# Altium schematic sheet SystemLevelR3.SchDoc
size E
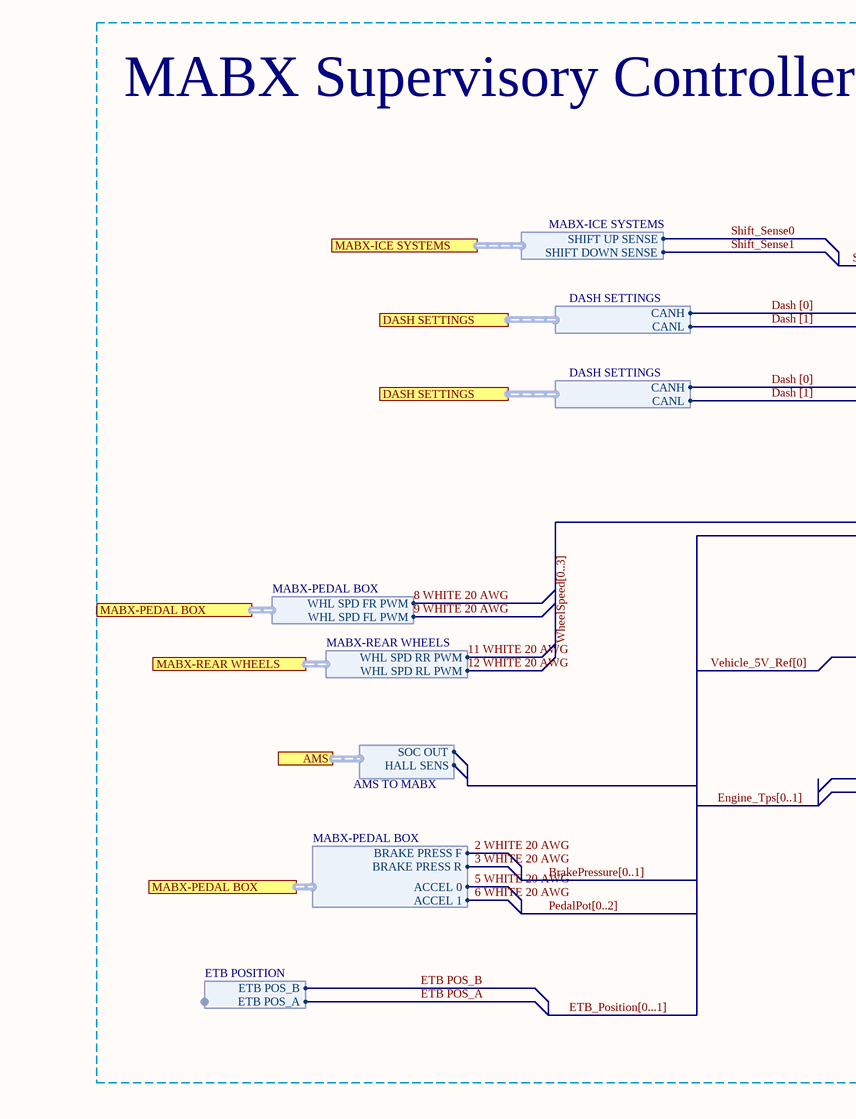
[diagram p0: SystemLevelR3.SchDoc, top left]
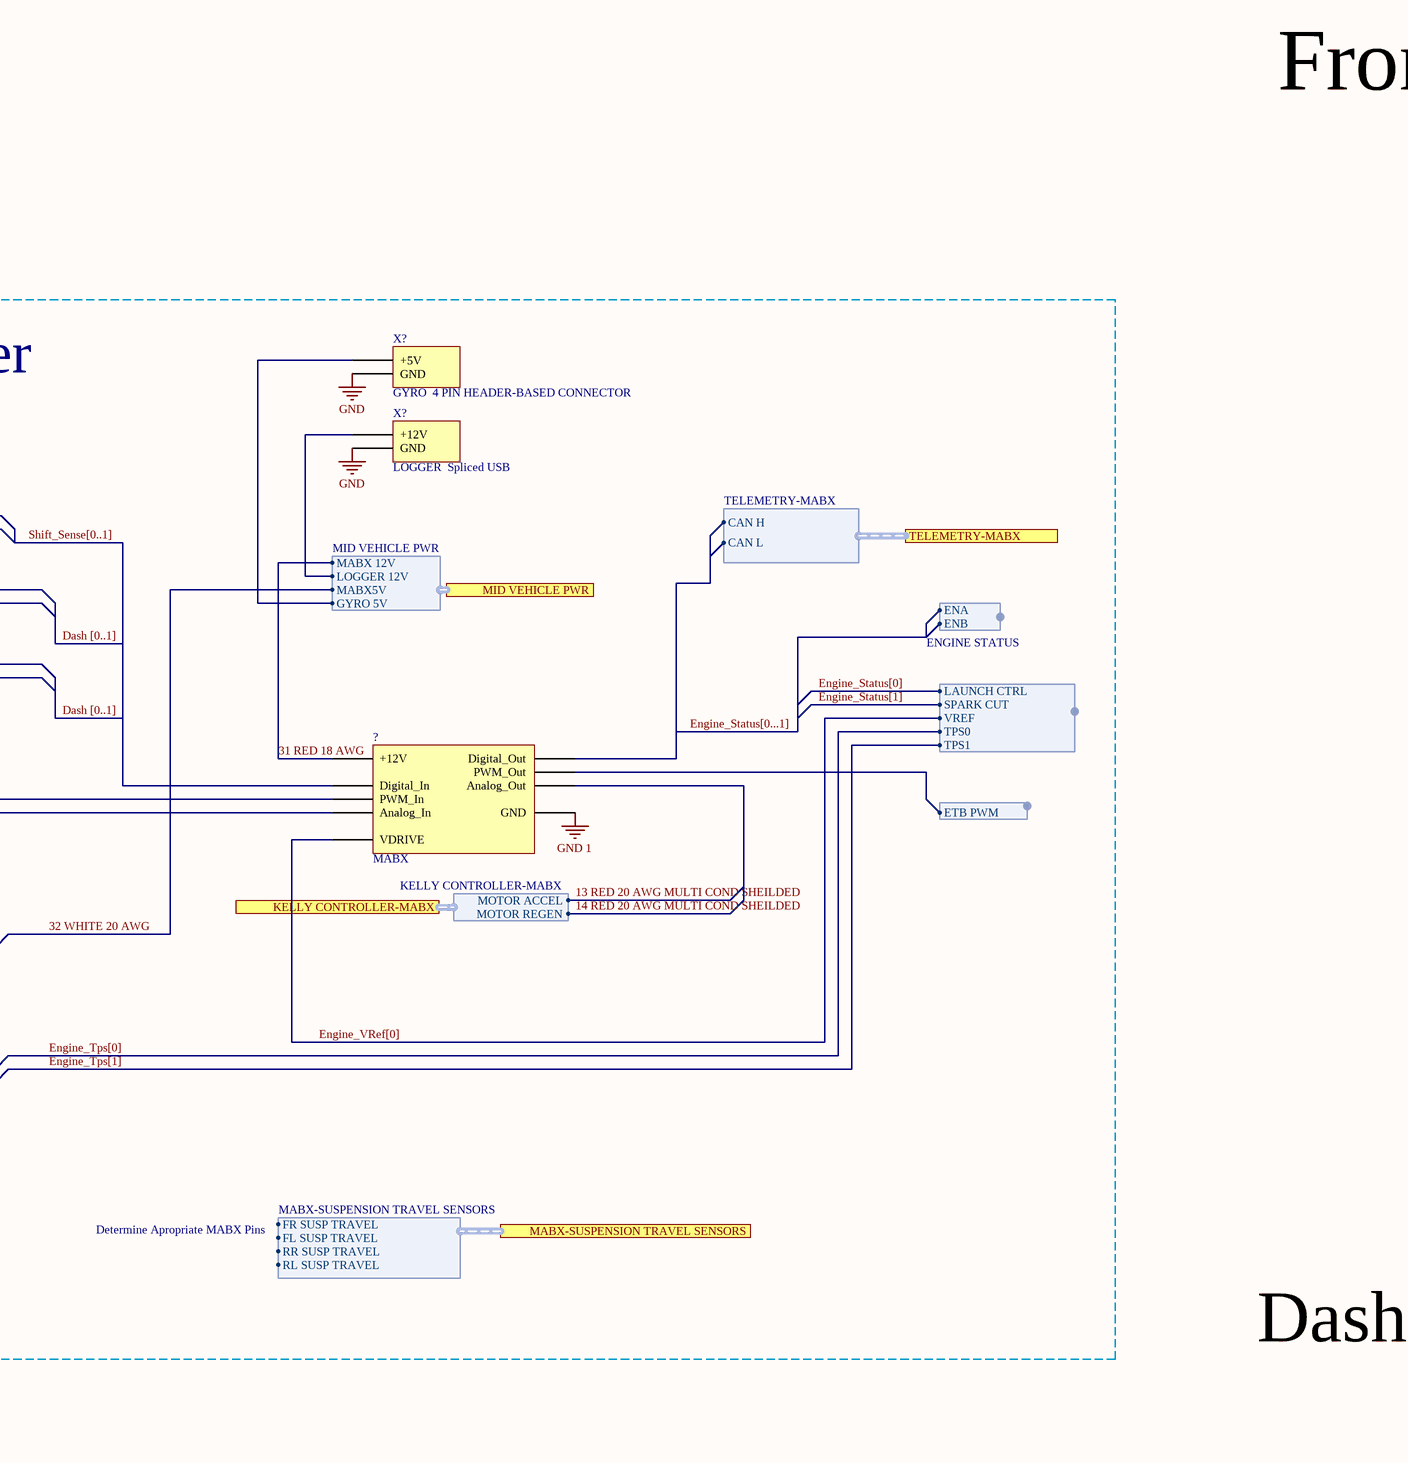
[diagram p1: SystemLevelR3.SchDoc, top middle]
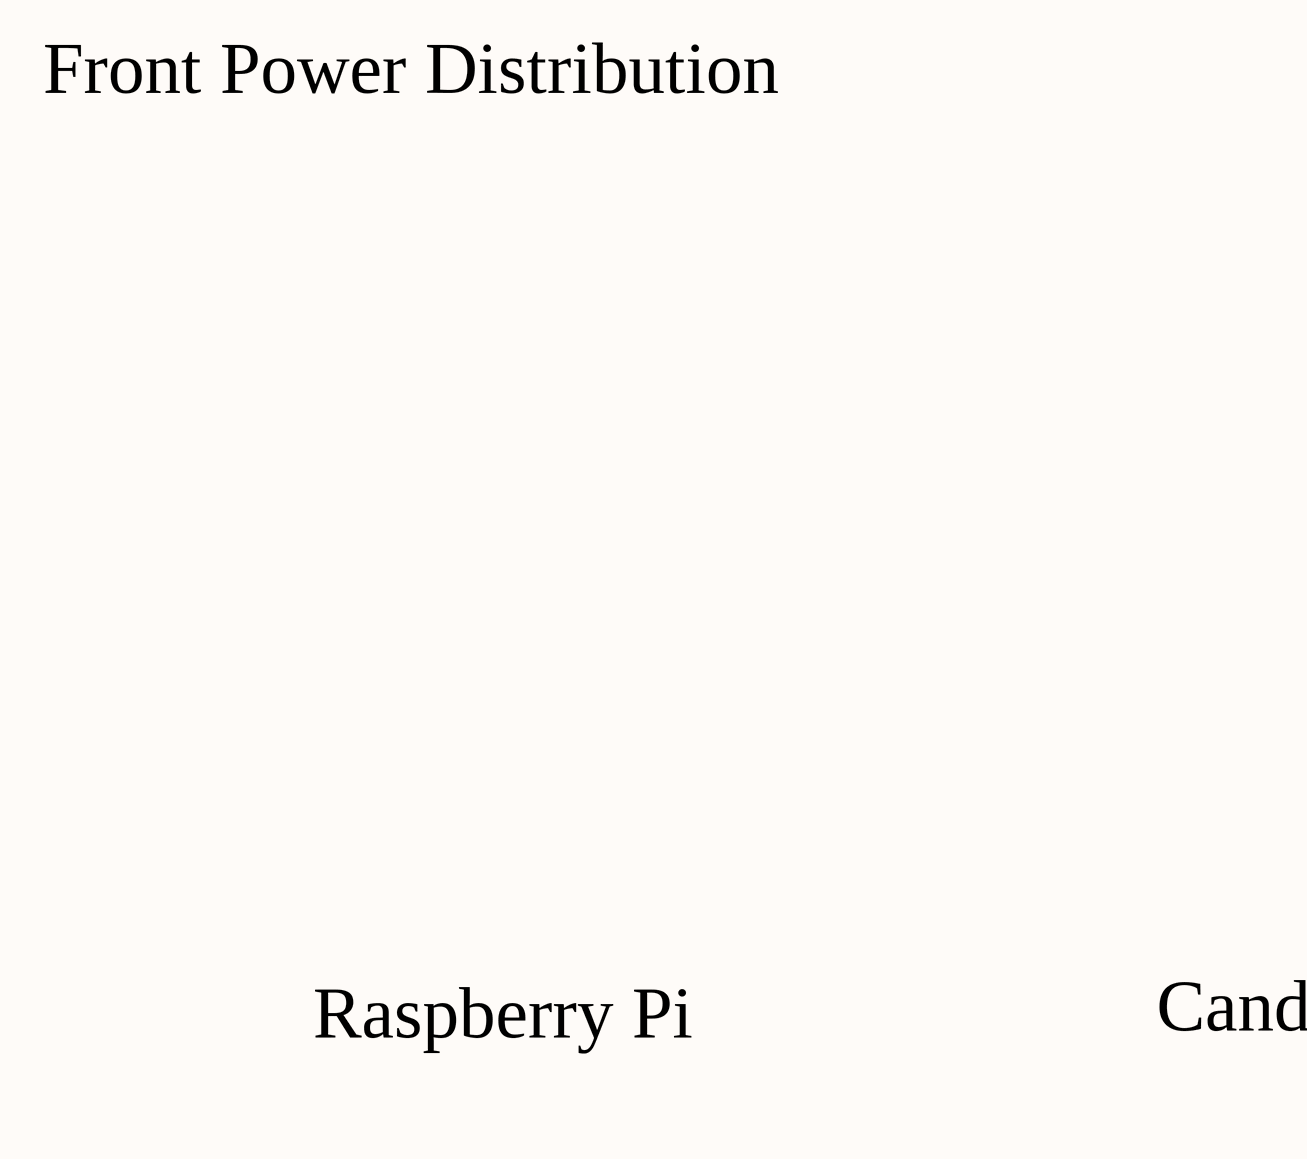
[diagram p2: SystemLevelR3.SchDoc, top right]
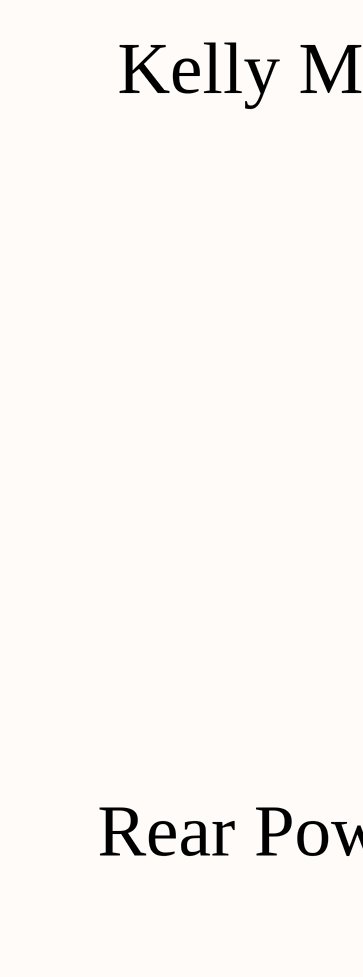
[diagram p3: SystemLevelR3.SchDoc, bottom left]
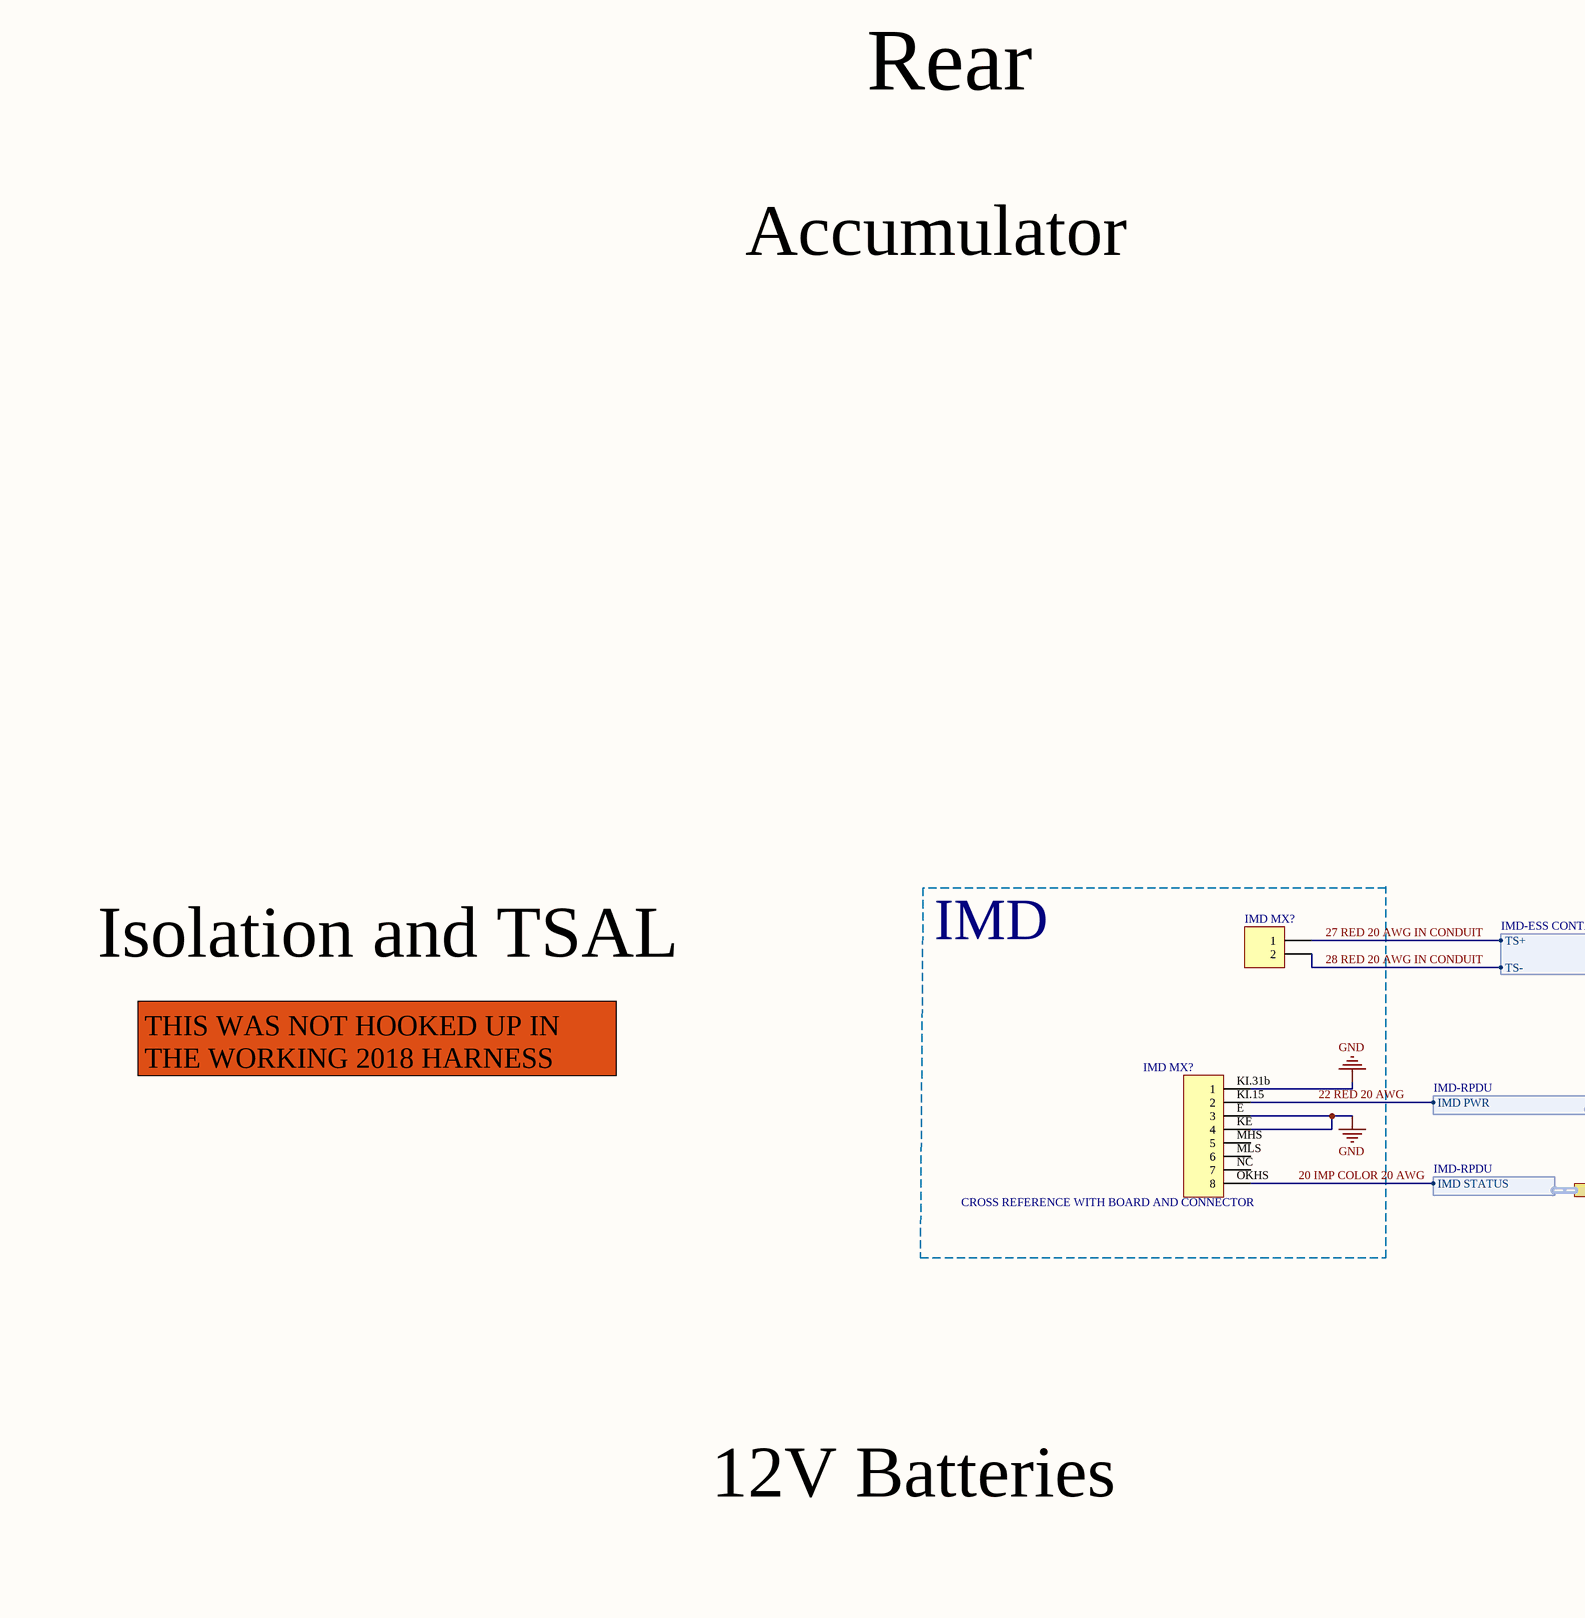
[diagram p4: SystemLevelR3.SchDoc, bottom middle]
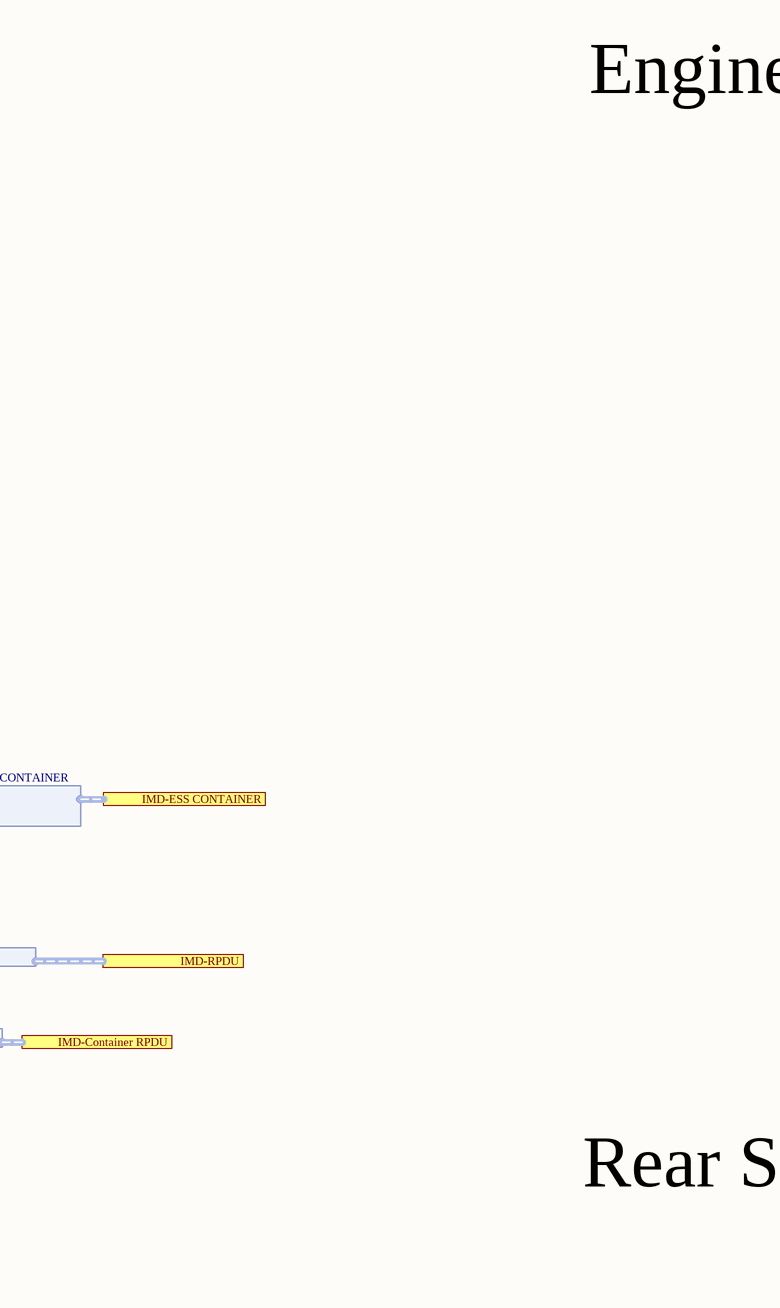
[diagram p5: SystemLevelR3.SchDoc, bottom right]

## Parts
(Parts that share a designator on the sheet are numbered #1, #2 ... from top to bottom, then left to right.)
?  MABX
IMD_MX?#1  Header 2  [HDR1X2]  (value not drawn)
IMD_MX?#2  CROSS REFERENCE WITH BOARD AND CONNECTOR  [HDR1X8]
X?#1  GYRO  4 PIN HEADER-BASED CONNECTOR
X?#2  LOGGER  Spliced USB

## Blocks framed on the sheet
MABX Supervisory Controller: ? X?#1 X?#2
IMD: IMD_MX?#1 IMD_MX?#2

## Ports
AMS (harness AMS TO MABX), DASH SETTINGS (harness DASH SETTINGS), IMD-Container RPDU (harness IMD-RPDU), IMD-ESS CONTAINER (harness IMD-ESS CONTAINER), IMD-RPDU (harness IMD-RPDU), KELLY CONTROLLER-MABX (harness KELLY CONTROLLER-MABX), MABX-ICE SYSTEMS (harness MABX-ICE SYSTEMS), MABX-PEDAL BOX (harness MABX-PEDAL BOX), MABX-REAR WHEELS (harness MABX-REAR WHEELS), MABX-SUSPENSION TRAVEL SENSORS (harness MABX-SUSPENSION TRAVEL SENSORS), MID VEHICLE PWR (harness MID VEHICLE PWR), TELEMETRY-MABX (harness TELEMETRY-MABX)

## Harnesses
ETB POSITION: ETB POS_A, ETB POS_B
MID VEHICLE PWR: MABX 12V, LOGGER 12V, GYRO 5V, MABX5V
MABX-PEDAL BOX: BRAKE PRESS F, BRAKE PRESS R, ACCEL 0, ACCEL 1
DASH SETTINGS: CANH, CANL
ENGINE STATUS: LAUNCH CTRL, SPARK CUT, VREF, TPS0, TPS1
AMS TO MABX: SOC OUT, HALL SENS
Harness: ENA, ENB
Harness: ETB PWM
TELEMETRY-MABX: CAN H, CAN L
MABX-ICE SYSTEMS: SHIFT UP SENSE, SHIFT DOWN SENSE
MABX-REAR WHEELS: WHL SPD RR PWM, WHL SPD RL PWM
KELLY CONTROLLER-MABX: MOTOR ACCEL, MOTOR REGEN
MABX-PEDAL BOX: WHL SPD FR PWM, WHL SPD FL PWM
MABX-SUSPENSION TRAVEL SENSORS: FR SUSP TRAVEL, FL SUSP TRAVEL, RR SUSP TRAVEL, RL SUSP TRAVEL
IMD-ESS CONTAINER: TS-, TS+
IMD-RPDU: IMD STATUS
IMD-RPDU: IMD PWR

## Nets
GND: IMD_MX?#2.E(3) IMD_MX?#2.KE(4) IMD_MX?#2.KI.31b(1) X?#1.2(GND) X?#2.2(GND)
GND 1: ?.2(GND)
2 WHITE 20 AWG: port MABX-PEDAL BOX.BRAKE PRESS F
3 WHITE 20 AWG: port MABX-PEDAL BOX.BRAKE PRESS R
5 WHITE 20 AWG: port MABX-PEDAL BOX.ACCEL 0
6 WHITE 20 AWG: port MABX-PEDAL BOX.ACCEL 1
8 WHITE 20 AWG: port MABX-PEDAL BOX.WHL SPD FR PWM
9 WHITE 20 AWG: port MABX-PEDAL BOX.WHL SPD FL PWM
11 WHITE 20 AWG: port MABX-REAR WHEELS.WHL SPD RR PWM
12 WHITE 20 AWG: port MABX-REAR WHEELS.WHL SPD RL PWM
13 RED 20 AWG MULTI COND SHEILDED: port KELLY CONTROLLER-MABX.MOTOR ACCEL
14 RED 20 AWG MULTI COND SHEILDED: port KELLY CONTROLLER-MABX.MOTOR REGEN
20 IMP COLOR 20 AWG: IMD_MX?#2.OKHS(8) ; port IMD-Container RPDU.IMD STATUS
22 RED 20 AWG: IMD_MX?#2.KI.15(2) ; port IMD-RPDU.IMD PWR
27 RED 20 AWG IN CONDUIT: IMD_MX?#1.1 ; port IMD-ESS CONTAINER.TS+
28 RED 20 AWG IN CONDUIT: IMD_MX?#1.2 ; port IMD-ESS CONTAINER.TS-
31 RED 18 AWG: ?.1(+12V) ; port MID VEHICLE PWR.MABX 12V
32 WHITE 20 AWG: port MID VEHICLE PWR.MABX5V
Dash [0]: port DASH SETTINGS.CANH
Dash [1]: port DASH SETTINGS.CANL
Engine_Status[0]: harness ENGINE STATUS.LAUNCH CTRL
Engine_Status[1]: harness ENGINE STATUS.SPARK CUT
Engine_Tps[0]: harness ENGINE STATUS.TPS0
Engine_Tps[1]: harness ENGINE STATUS.TPS1
Engine_VRef[0]: ?.6(VDRIVE) ; harness ENGINE STATUS.VREF
ETB POS_A: harness ETB POSITION.ETB POS_A
ETB POS_B: harness ETB POSITION.ETB POS_B
Shift_Sense0: port MABX-ICE SYSTEMS.SHIFT UP SENSE  [project net Dash 0]
Shift_Sense1: port MABX-ICE SYSTEMS.SHIFT DOWN SENSE  [project net Dash 1]
NetX?#1_1: X?#1.1(+5V) ; port MID VEHICLE PWR.GYRO 5V
NetX?#2_1: X?#2.1(+12V) ; port MID VEHICLE PWR.LOGGER 12V

Not connected (* = marked no-connect by the designer): ? 3(Digital_In) 4(Analog_In) 5(Digital_Out); IMD_MX?#2 MHS(5) MLS(6) NC(7)

## Buses and harness runs
bus BrakePressure[0..1] = Engine_Tps[0..1] = ETB_Position[0...1] = PedalPot[0..2] = Vehicle_5V_Ref[0]
bus Dash [0..1] = Shift_Sense[0..1]
bus Engine_Status[0...1]
bus WheelSpeed[0..3]

## Notes on the sheet
- Front
- Front Power Distribution
- Determine Apropriate MABX Pins
- Raspberry Pi
- Canduino
- Dash
- Rear
- Kelly Motor Controller
- Accumulator
- Engine Harness
- Isolation and TSAL
- Rear Power Distribution
- THIS WAS NOT HOOKED UP IN THE WORKING 2018 HARNESS
- Rear Sensors
- 12V Batteries
- Labels drawn without touching a wire or pin: WheelSpeed[0..3]
- Title
- Size:
- Date:
- File:
- C
- Number:
- Time:
- Revision:
- Sheet
- of

## Library data of the parts
IMD_MX?#1 = Header 2: Header, 2-Pin; LatestRevisionDate: 17-Jul-2002; LatestRevisionNote: Re-released for DXP Platform.; Publisher: Altium Limited
IMD_MX?#2 = Header 8: Header, 8-Pin; LatestRevisionDate: 17-Jul-2002; LatestRevisionNote: Re-released for DXP Platform.; Publisher: Altium Limited
X?#1 = 5V LOAD
X?#2 = 12V_Load